# Altium schematic sheet LedMatrix.SchDoc
size A3
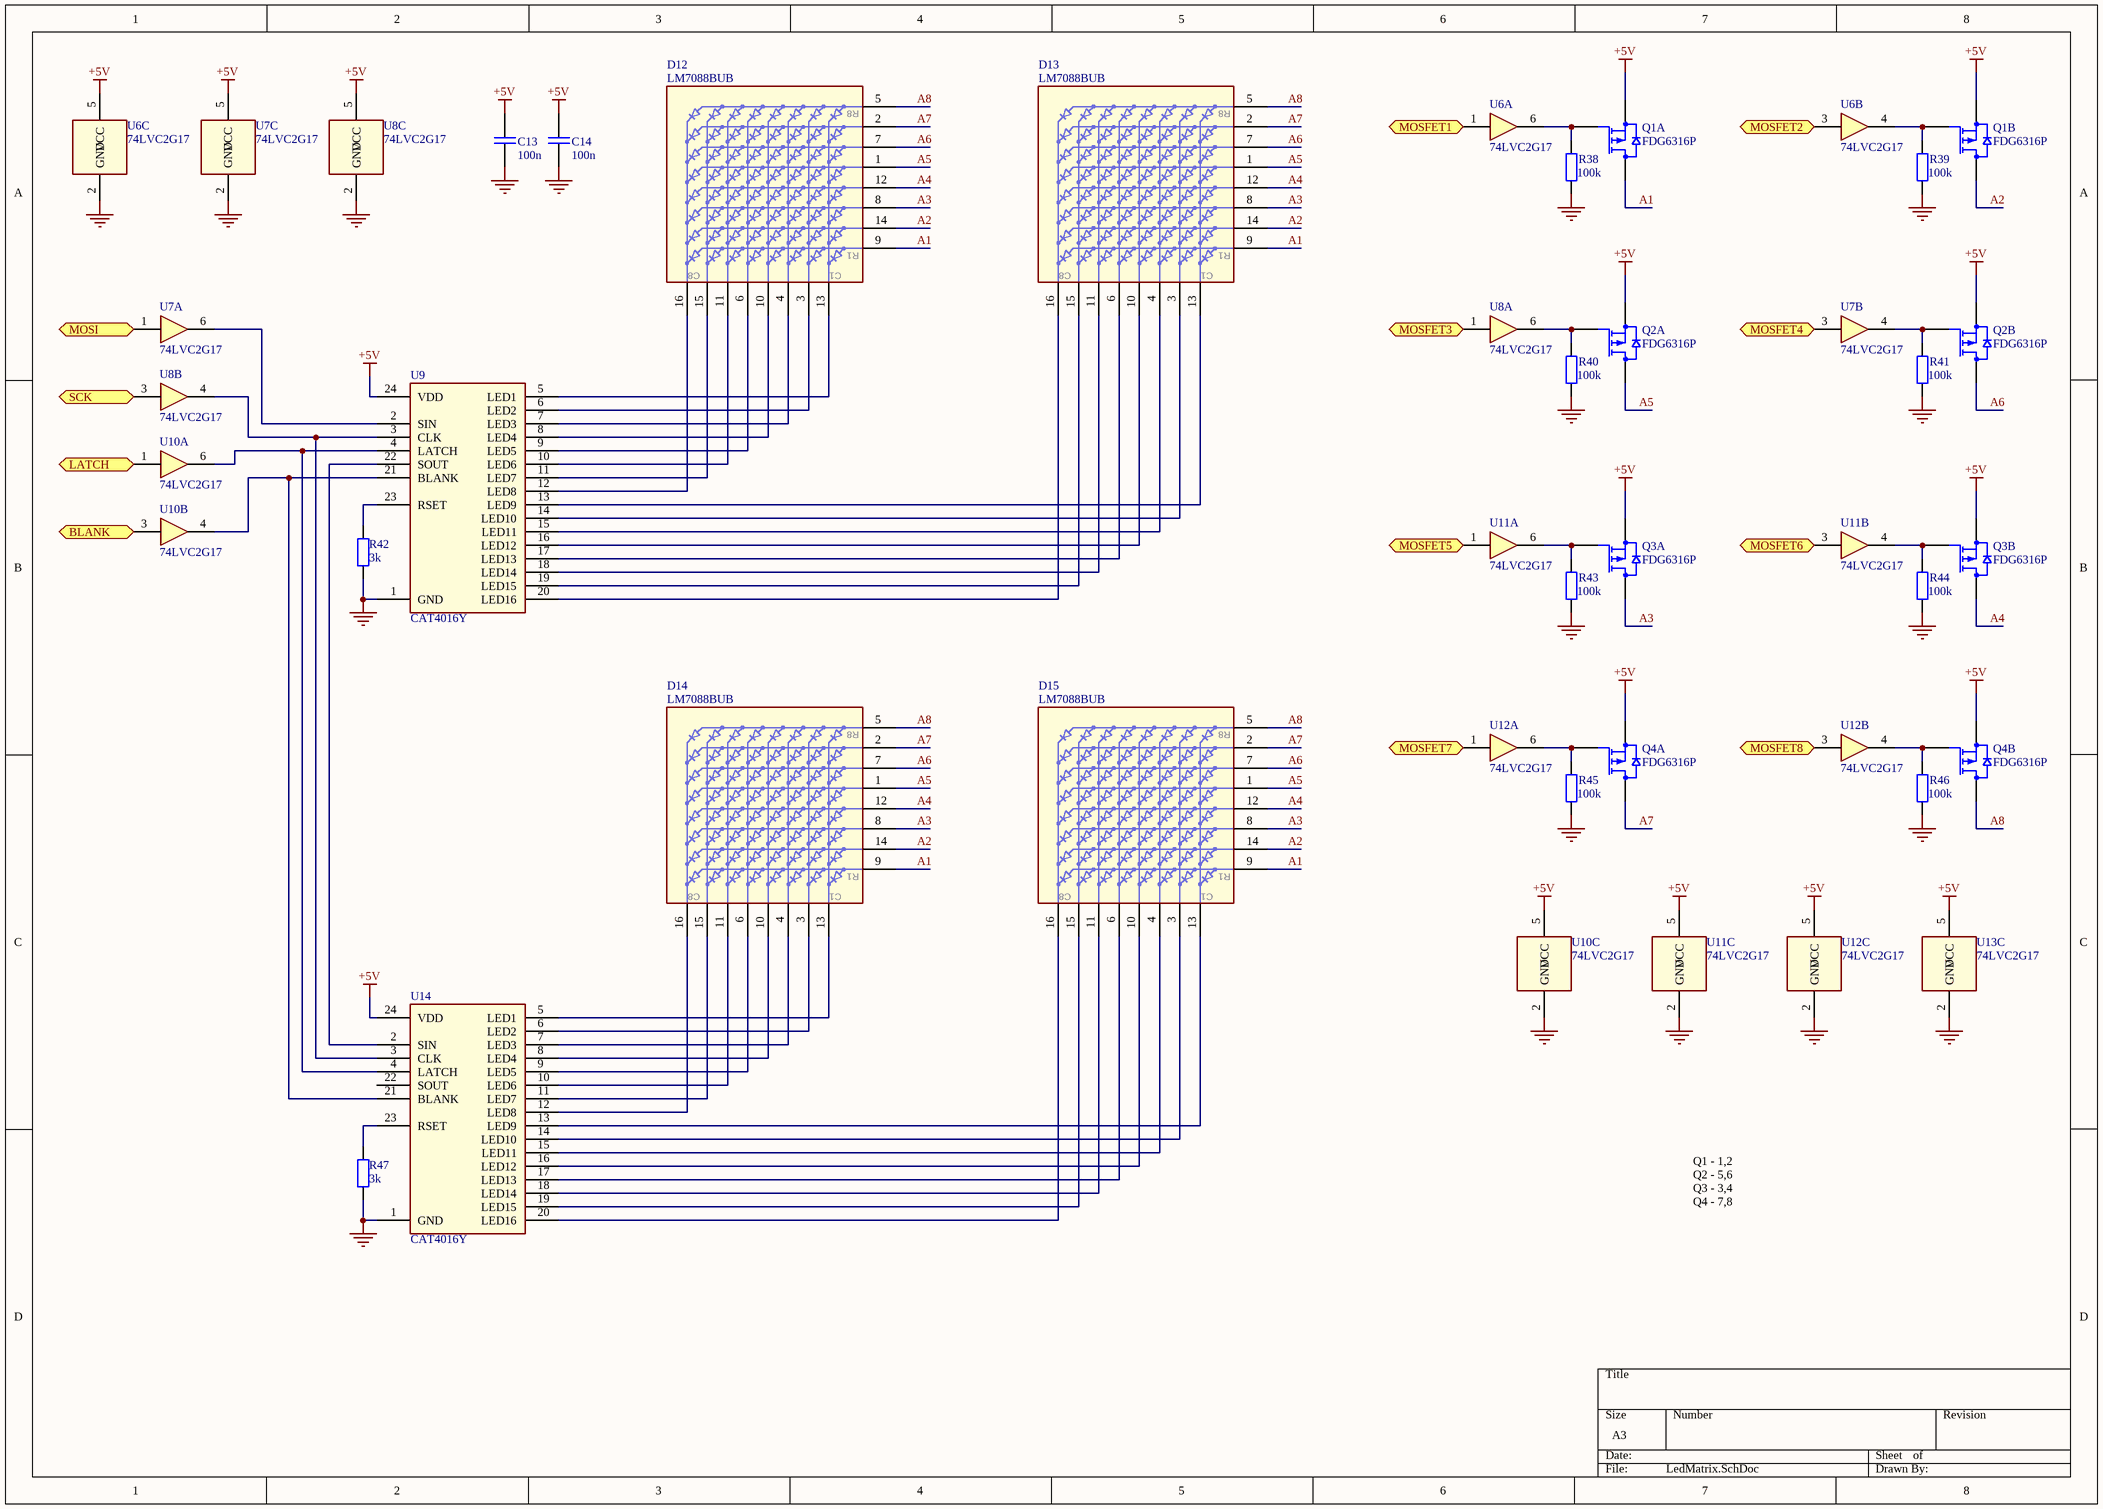
[diagram p0: LedMatrix.SchDoc]

## Parts
C13  100n  [Cap 0603]
C14  100n  [Cap 0603]
D12  LM7088BUB  [KWM-19881 Series]
D13  LM7088BUB  [KWM-19881 Series]
D14  LM7088BUB  [KWM-19881 Series]
D15  LM7088BUB  [KWM-19881 Series]
Q1  FDG6316P  [SC-70-6 (SOT-363)]  (parts A,B of 2)
Q2  FDG6316P  [SC-70-6 (SOT-363)]  (parts A,B of 2)
Q3  FDG6316P  [SC-70-6 (SOT-363)]  (parts A,B of 2)
Q4  FDG6316P  [SC-70-6 (SOT-363)]  (parts A,B of 2)
R38  100k  [Res 0603]
R39  100k  [Res 0603]
R40  100k  [Res 0603]
R41  100k  [Res 0603]
R42  3k  [Res 0603]
R43  100k  [Res 0603]
R44  100k  [Res 0603]
R45  100k  [Res 0603]
R46  100k  [Res 0603]
R47  3k  [Res 0603]
U6  74LVC2G17  [SOT-23-6]  (parts A,B,C of 3)
U7  74LVC2G17  [SOT-23-6]  (parts A,B,C of 3)
U8  74LVC2G17  [SOT-23-6]  (parts A,B,C of 3)
U9  CAT4016Y  [TSSOP-24]
U10  74LVC2G17  [SOT-23-6]  (parts A,B,C of 3)
U11  74LVC2G17  [SOT-23-6]  (parts A,B,C of 3)
U12  74LVC2G17  [SOT-23-6]  (parts A,B,C of 3)
U13  74LVC2G17  [SOT-23-6]  (part C of 3)
U14  CAT4016Y  [TSSOP-24]

## Ports
BLANK, LATCH, MOSFET1, MOSFET2, MOSFET3, MOSFET4, MOSFET5, MOSFET6, MOSFET7, MOSFET8, MOSI, SCK

## Nets
+5V: C13.1 C14.1 Q1.1(S1) Q1.4(S2) Q2.1(S1) Q2.4(S2) Q3.1(S1) Q3.4(S2) Q4.1(S1) Q4.4(S2) U6.5(VCC) U7.5(VCC) U8.5(VCC) U9.24(VDD) U10.5(VCC) U11.5(VCC) U12.5(VCC) U13.5(VCC) U14.24(VDD)
GND: C13.2 C14.2 R38.1 R39.1 R40.1 R41.1 R42.1 R43.1 R44.1 R45.1 R46.1 R47.1 U6.2(GND) U7.2(GND) U8.2(GND) U9.1(GND) U10.2(GND) U11.2(GND) U12.2(GND) U13.2(GND) U14.1(GND)
A1: D12.9(R1) D13.9(R1) D14.9(R1) D15.9(R1) Q1.6(D1)
A2: D12.14(R2) D13.14(R2) D14.14(R2) D15.14(R2) Q1.3(D2)
A3: D12.8(R3) D13.8(R3) D14.8(R3) D15.8(R3) Q3.6(D1)
A4: D12.12(R4) D13.12(R4) D14.12(R4) D15.12(R4) Q3.3(D2)
A5: D12.1(R5) D13.1(R5) D14.1(R5) D15.1(R5) Q2.6(D1)
A6: D12.7(R6) D13.7(R6) D14.7(R6) D15.7(R6) Q2.3(D2)
A7: D12.2(R7) D13.2(R7) D14.2(R7) D15.2(R7) Q4.6(D1)
A8: D12.5(R8) D13.5(R8) D14.5(R8) D15.5(R8) Q4.3(D2)
BLANK: U10.3 ; port BLANK
LATCH: U10.1 ; port LATCH
MOSFET1: U6.1 ; port MOSFET1
MOSFET2: U6.3 ; port MOSFET2
MOSFET3: U8.1 ; port MOSFET3
MOSFET4: U7.3 ; port MOSFET4
MOSFET5: U11.1 ; port MOSFET5
MOSFET6: U11.3 ; port MOSFET6
MOSFET7: U12.1 ; port MOSFET7
MOSFET8: U12.3 ; port MOSFET8
MOSI: U7.1 ; port MOSI
SCK: U8.3 ; port SCK
NetD12_3: D12.3(C2) U9.6(LED2)
NetD12_4: D12.4(C3) U9.7(LED3)
NetD12_6: D12.6(C5) U9.9(LED5)
NetD12_10: D12.10(C4) U9.8(LED4)
NetD12_11: D12.11(C6) U9.10(LED6)
NetD12_13: D12.13(C1) U9.5(LED1)
NetD12_15: D12.15(C7) U9.11(LED7)
NetD12_16: D12.16(C8) U9.12(LED8)
NetD13_3: D13.3(C2) U9.14(LED10)
NetD13_4: D13.4(C3) U9.15(LED11)
NetD13_6: D13.6(C5) U9.17(LED13)
NetD13_10: D13.10(C4) U9.16(LED12)
NetD13_11: D13.11(C6) U9.18(LED14)
NetD13_13: D13.13(C1) U9.13(LED9)
NetD13_15: D13.15(C7) U9.19(LED15)
NetD13_16: D13.16(C8) U9.20(LED16)
NetD14_3: D14.3(C2) U14.6(LED2)
NetD14_4: D14.4(C3) U14.7(LED3)
NetD14_6: D14.6(C5) U14.9(LED5)
NetD14_10: D14.10(C4) U14.8(LED4)
NetD14_11: D14.11(C6) U14.10(LED6)
NetD14_13: D14.13(C1) U14.5(LED1)
NetD14_15: D14.15(C7) U14.11(LED7)
NetD14_16: D14.16(C8) U14.12(LED8)
NetD15_3: D15.3(C2) U14.14(LED10)
NetD15_4: D15.4(C3) U14.15(LED11)
NetD15_6: D15.6(C5) U14.17(LED13)
NetD15_10: D15.10(C4) U14.16(LED12)
NetD15_11: D15.11(C6) U14.18(LED14)
NetD15_13: D15.13(C1) U14.13(LED9)
NetD15_15: D15.15(C7) U14.19(LED15)
NetD15_16: D15.16(C8) U14.20(LED16)
NetQ1_2: Q1.2(G1) R38.2 U6.6
NetQ1_5: Q1.5(G2) R39.2 U6.4
NetQ2_2: Q2.2(G1) R40.2 U8.6
NetQ2_5: Q2.5(G2) R41.2 U7.4
NetQ3_2: Q3.2(G1) R43.2 U11.6
NetQ3_5: Q3.5(G2) R44.2 U11.4
NetQ4_2: Q4.2(G1) R45.2 U12.6
NetQ4_5: Q4.5(G2) R46.2 U12.4
NetR42_2: R42.2 U9.23(RSET)
NetR47_2: R47.2 U14.23(RSET)
NetU7_6: U7.6 U9.2(SIN)
NetU8_4: U8.4 U9.3(CLK) U14.3(CLK)
NetU9_4: U9.4(LATCH) U10.6 U14.4(LATCH)
NetU9_21: U9.21(BLANK) U10.4 U14.21(BLANK)
NetU9_22: U9.22(SOUT) U14.2(SIN)

Not connected (* = marked no-connect by the designer): U14 22(SOUT)

## Notes on the sheet
- Q1 - 1,2
  Q2 - 5,6
  Q3 - 3,4
  Q4 - 7,8

## Library data of the parts
C13 C14 = Cap: Capacitor
D12-D15 = D LED LM7088BUB: 8x8 Dot Matrix LED Display (Common Row Anode), Blue
Q1-Q4 = Q FDG6316P: P-Channel 1.8V Specified PowerTrench MOSFET
R38-R47 = Res: Resistor
U6-U8 U10-U13 = 74LVC2G17: Dual non-inverting Schmitt trigger with 5 V tolerant input
U9 U14 = CAT4016Y: 16-Channel Constant Current LED Driver